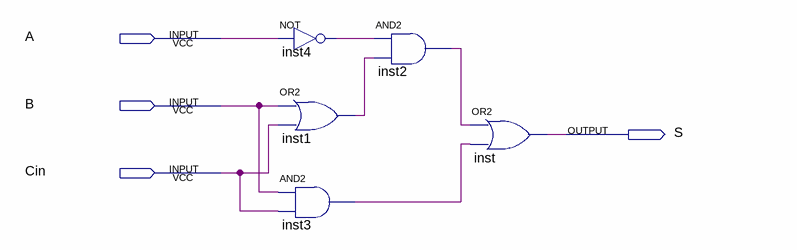
[diagram p0: schematic sheet]
// Quartus schematic Comparador_bit_sinal.bdf as structural Verilog: 5 symbols, 4 pins
module Comparador_bit_sinal (
  input  A,
  input  B,
  input  Cin,
  output S
);

  wire inst1_out, inst2_out, inst3_out, inst4_out;

  not inst4 (inst4_out, A);
  or inst1 (inst1_out, B, Cin);
  and inst3 (inst3_out, B, Cin);
  and inst2 (inst2_out, inst4_out, inst1_out);
  or inst (S, inst2_out, inst3_out);
endmodule
